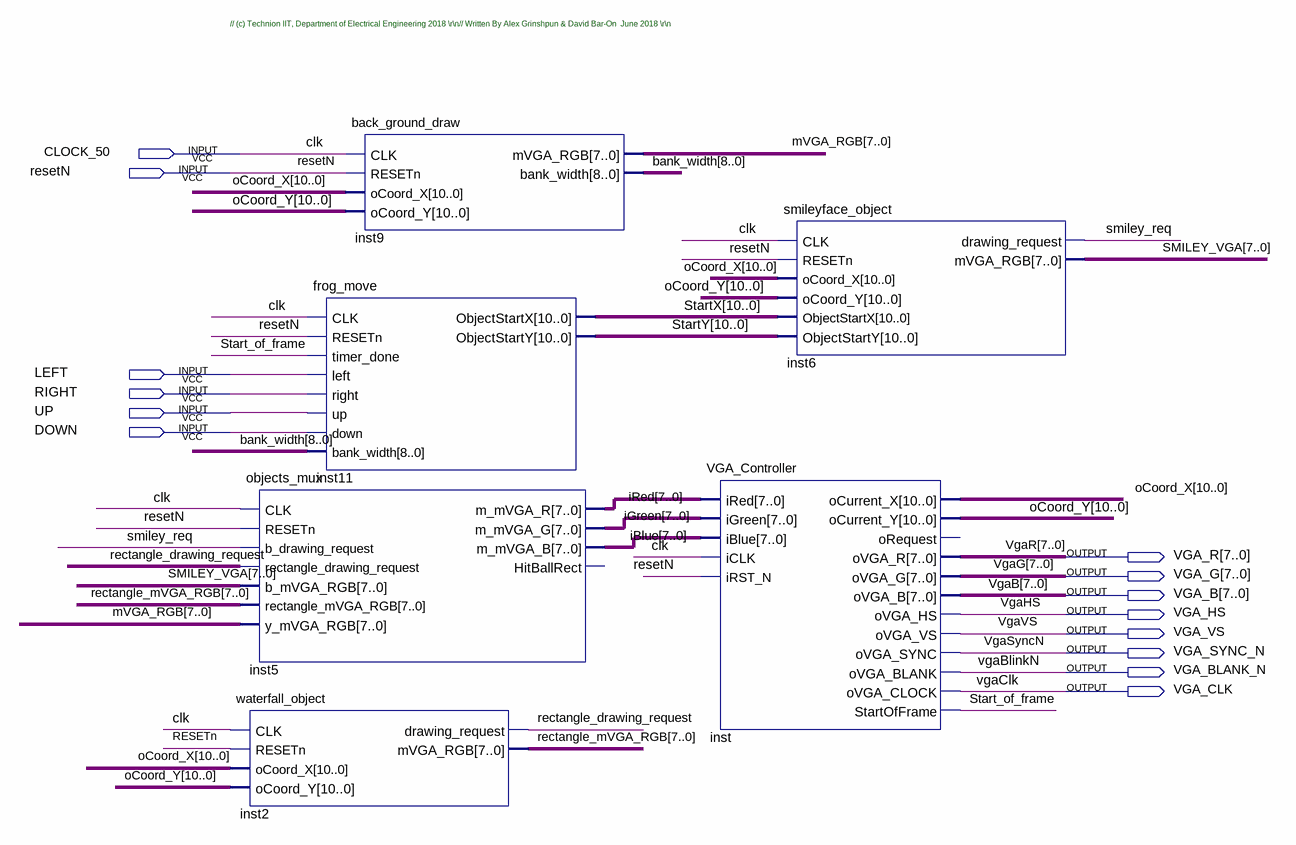
[diagram p0: schematic sheet]
// Quartus schematic TOP_VGA_DEMO.bdf as structural Verilog: 6 symbols, 14 pins
module TOP_VGA_DEMO (
  input  CLOCK_50,
  input  resetN,
  input  LEFT,
  input  RIGHT,
  input  UP,
  input  DOWN,
  output [7:0] VGA_R,
  output [7:0] VGA_G,
  output [7:0] VGA_B,
  output VGA_HS,
  output VGA_VS,
  output VGA_SYNC_N,
  output VGA_BLANK_N,
  output VGA_CLK
);

  wire rectangle_drawing_request, smiley_req, Start_of_frame;
  wire [7:0] iBlue, iGreen, iRed, mVGA_RGB, rectangle_mVGA_RGB, SMILEY_VGA;
  wire [8:0] bank_width;
  wire [10:0] oCoord_X, oCoord_Y, StartX, StartY;

  objects_mux inst5 (
    .CLK(CLOCK_50), .RESETn(resetN), .b_drawing_request(smiley_req),
    .rectangle_drawing_request(rectangle_drawing_request), .b_mVGA_RGB(SMILEY_VGA),
    .rectangle_mVGA_RGB(rectangle_mVGA_RGB), .y_mVGA_RGB(mVGA_RGB), .m_mVGA_R(iRed), .m_mVGA_G(iGreen),
    .m_mVGA_B(iBlue));  // open: HitBallRect
  waterfall_object inst2 (
    .CLK(CLOCK_50), .RESETn(resetN), .oCoord_X(oCoord_X), .oCoord_Y(oCoord_Y),
    .drawing_request(rectangle_drawing_request), .mVGA_RGB(rectangle_mVGA_RGB));
  frog_move inst11 (
    .CLK(CLOCK_50), .RESETn(resetN), .timer_done(Start_of_frame), .left(LEFT), .right(RIGHT), .up(UP),
    .down(DOWN), .bank_width(bank_width), .ObjectStartX(StartX), .ObjectStartY(StartY));
  back_ground_draw inst9 (
    .CLK(CLOCK_50), .RESETn(resetN), .oCoord_X(oCoord_X), .oCoord_Y(oCoord_Y), .mVGA_RGB(mVGA_RGB),
    .bank_width(bank_width));
  VGA_Controller inst (
    .iRed(iRed), .iGreen(iGreen), .iBlue(iBlue), .iCLK(CLOCK_50), .iRST_N(resetN), .oCurrent_X(oCoord_X),
    .oCurrent_Y(oCoord_Y), .oVGA_R(VGA_R), .oVGA_G(VGA_G), .oVGA_B(VGA_B), .oVGA_HS(VGA_HS),
    .oVGA_VS(VGA_VS), .oVGA_SYNC(VGA_SYNC_N), .oVGA_BLANK(VGA_BLANK_N), .oVGA_CLOCK(VGA_CLK),
    .StartOfFrame(Start_of_frame));  // open: oRequest
  smileyface_object inst6 (
    .CLK(CLOCK_50), .RESETn(resetN), .oCoord_X(oCoord_X), .oCoord_Y(oCoord_Y), .ObjectStartX(StartX),
    .ObjectStartY(StartY), .drawing_request(smiley_req), .mVGA_RGB(SMILEY_VGA));

  // Other names for the same wires on the sheet: clk = CLOCK_50; VgaB[7:0] = VGA_B; vgaBlinkN = VGA_BLANK_N;
  //   vgaClk = VGA_CLK; VgaG[7:0] = VGA_G; VgaHS = VGA_HS; VgaR[7:0] = VGA_R; VgaSyncN = VGA_SYNC_N; VgaVS = VGA_VS

  // Notes on the sheet:
  //   // (c) Technion IIT, Department of Electrical Engineering 2018 \r\n// Written By Alex Grinshpun & David Bar-On  June 2018 \r\n
endmodule
